# EAGLE design bristol_longshot (EAGLE 7.3.0)
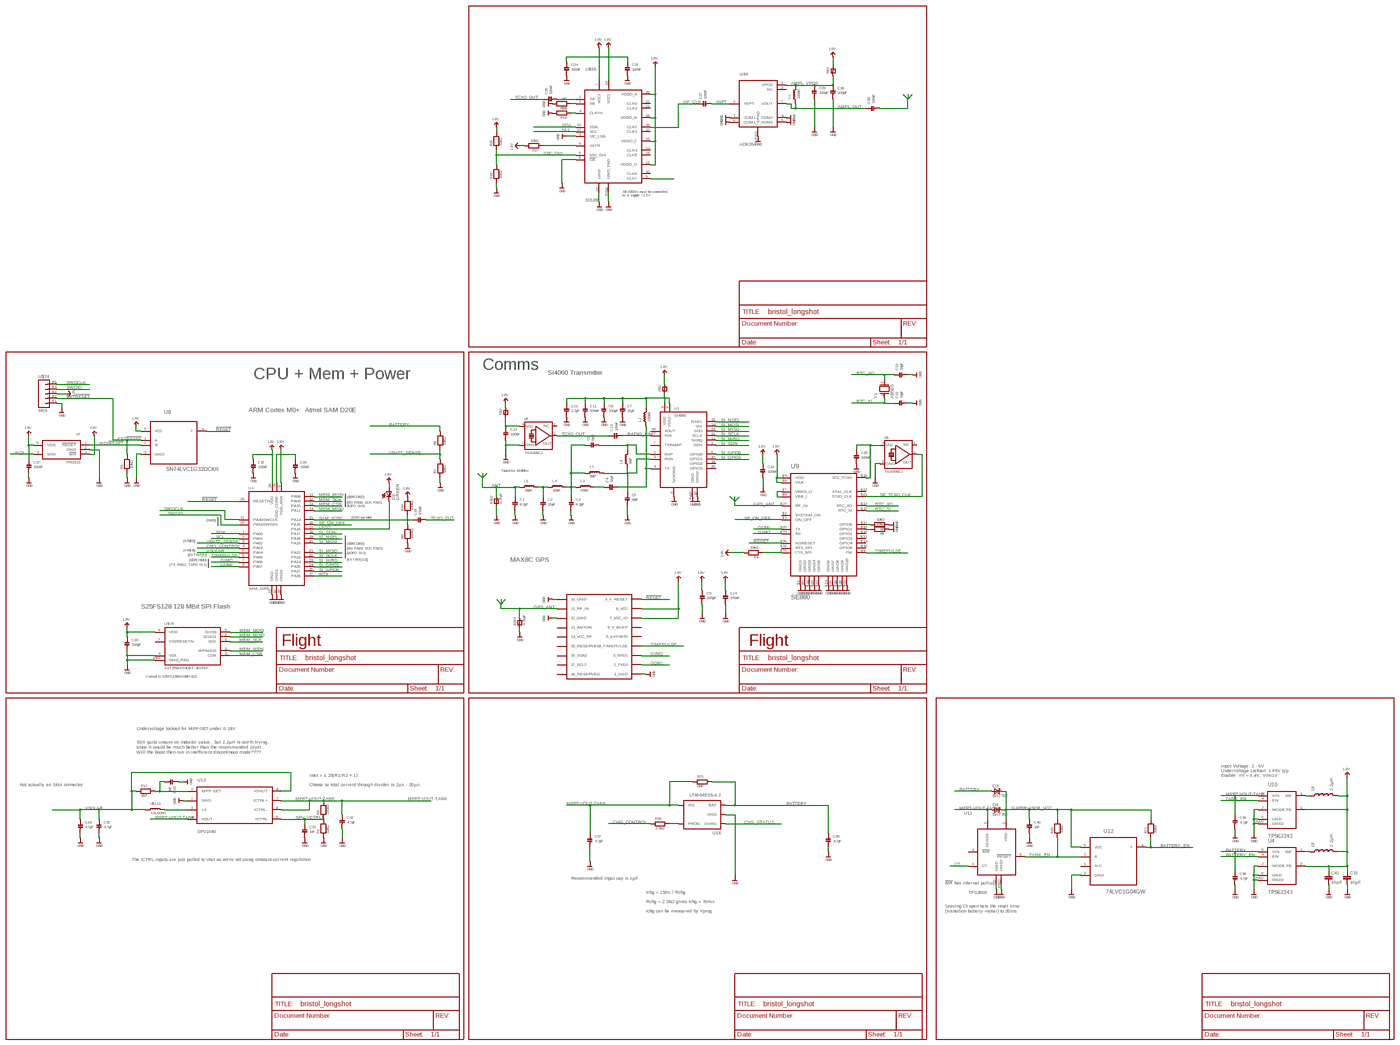
[diagram p0: schematic, sheet 1, overview]
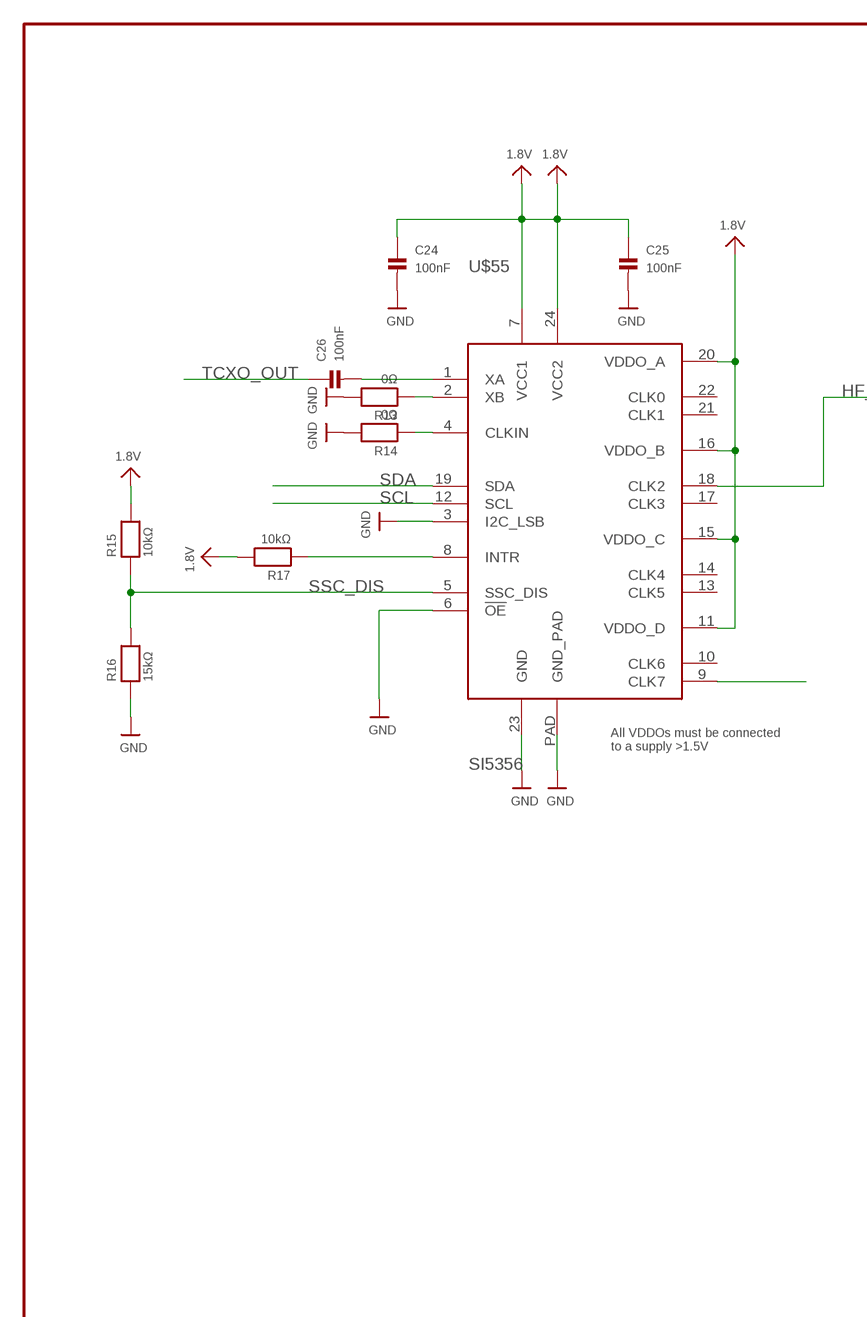
[diagram p1: schematic, sheet 1, part 1 of 4]
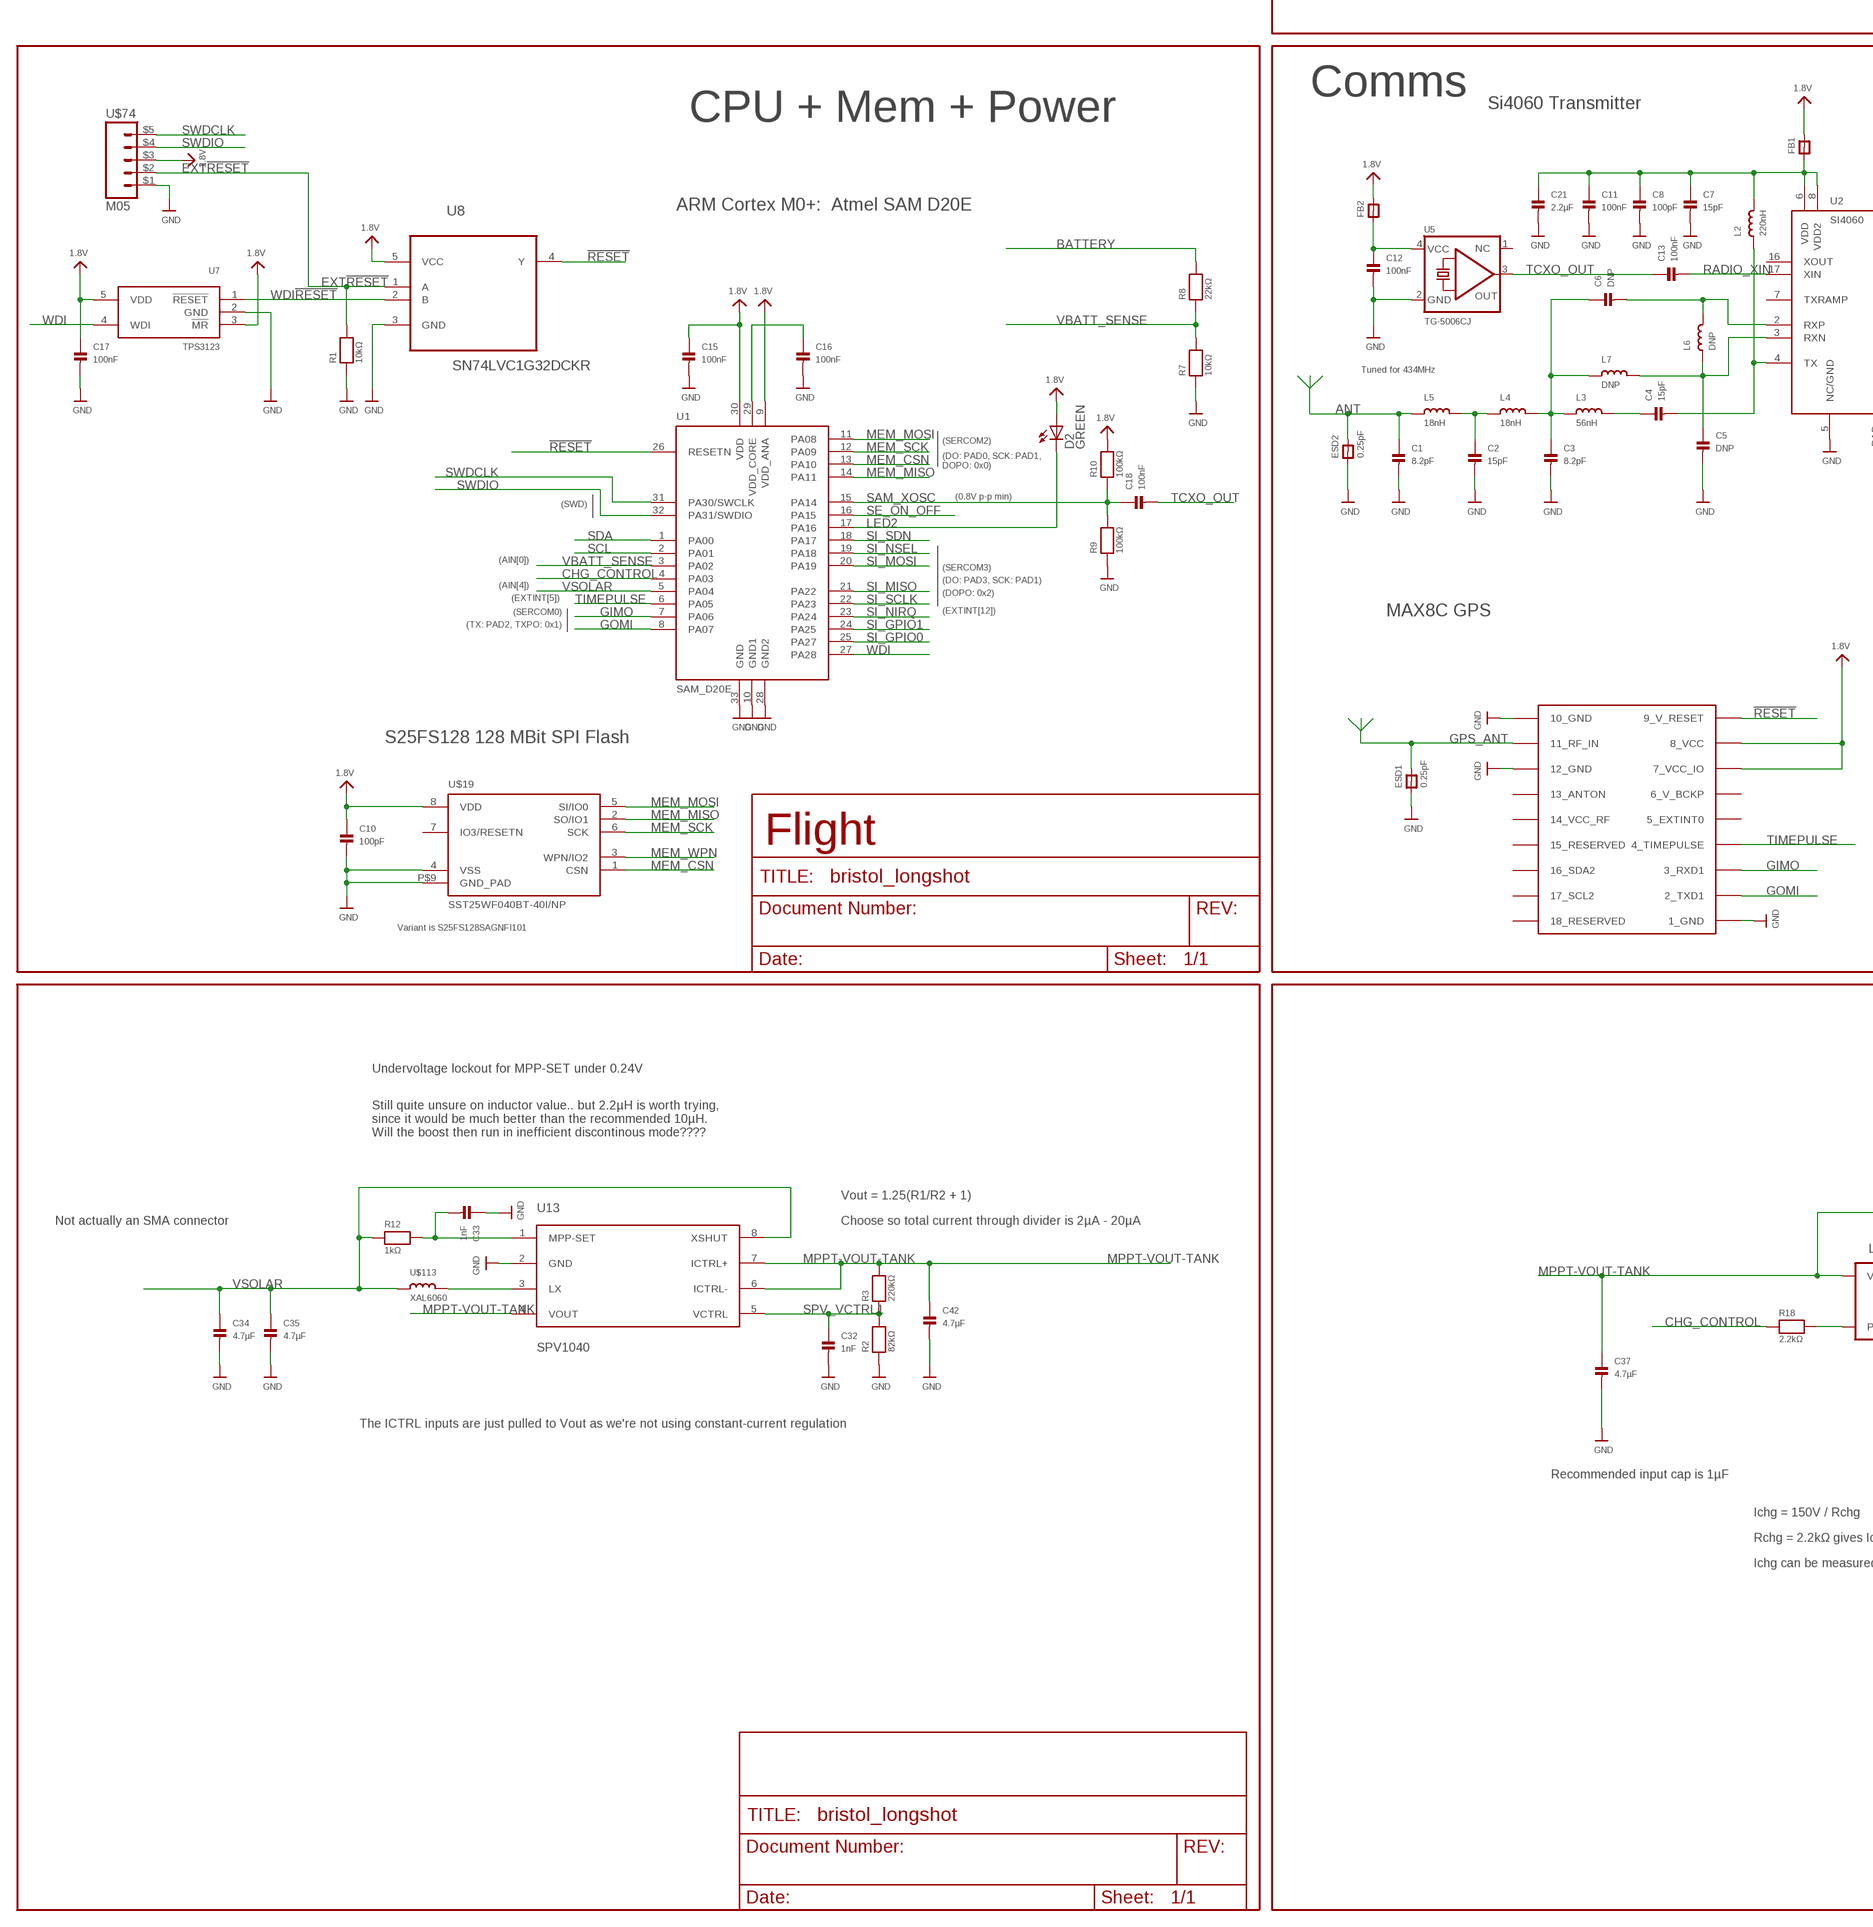
[diagram p2: schematic, sheet 1, part 2 of 4]
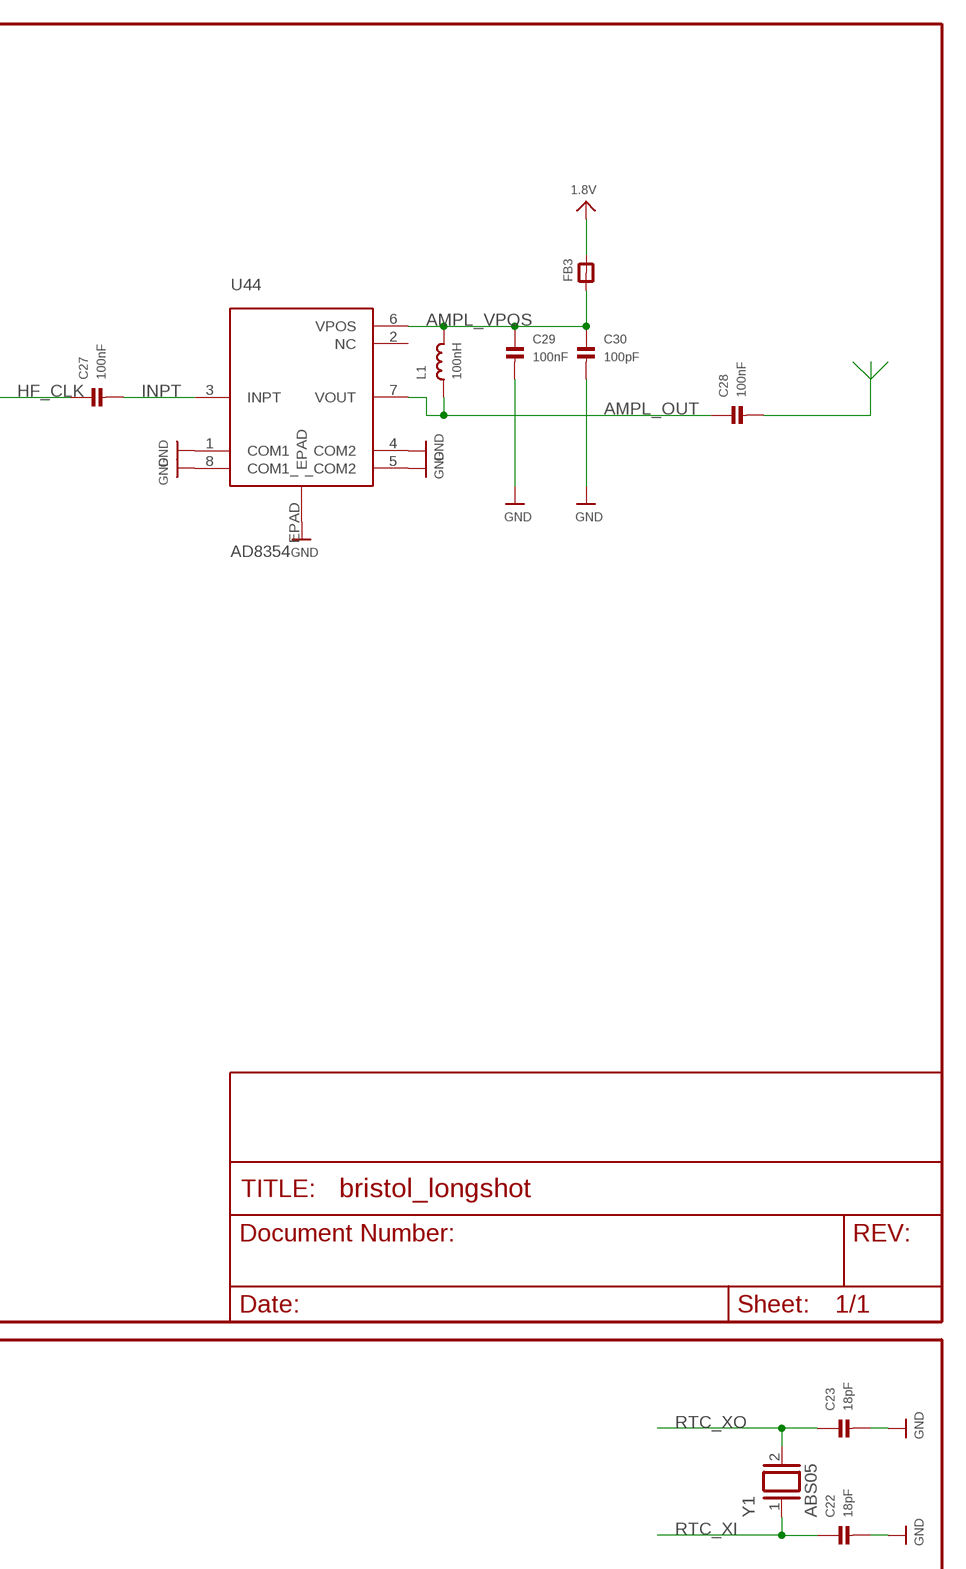
[diagram p3: schematic, sheet 1, part 3 of 4]
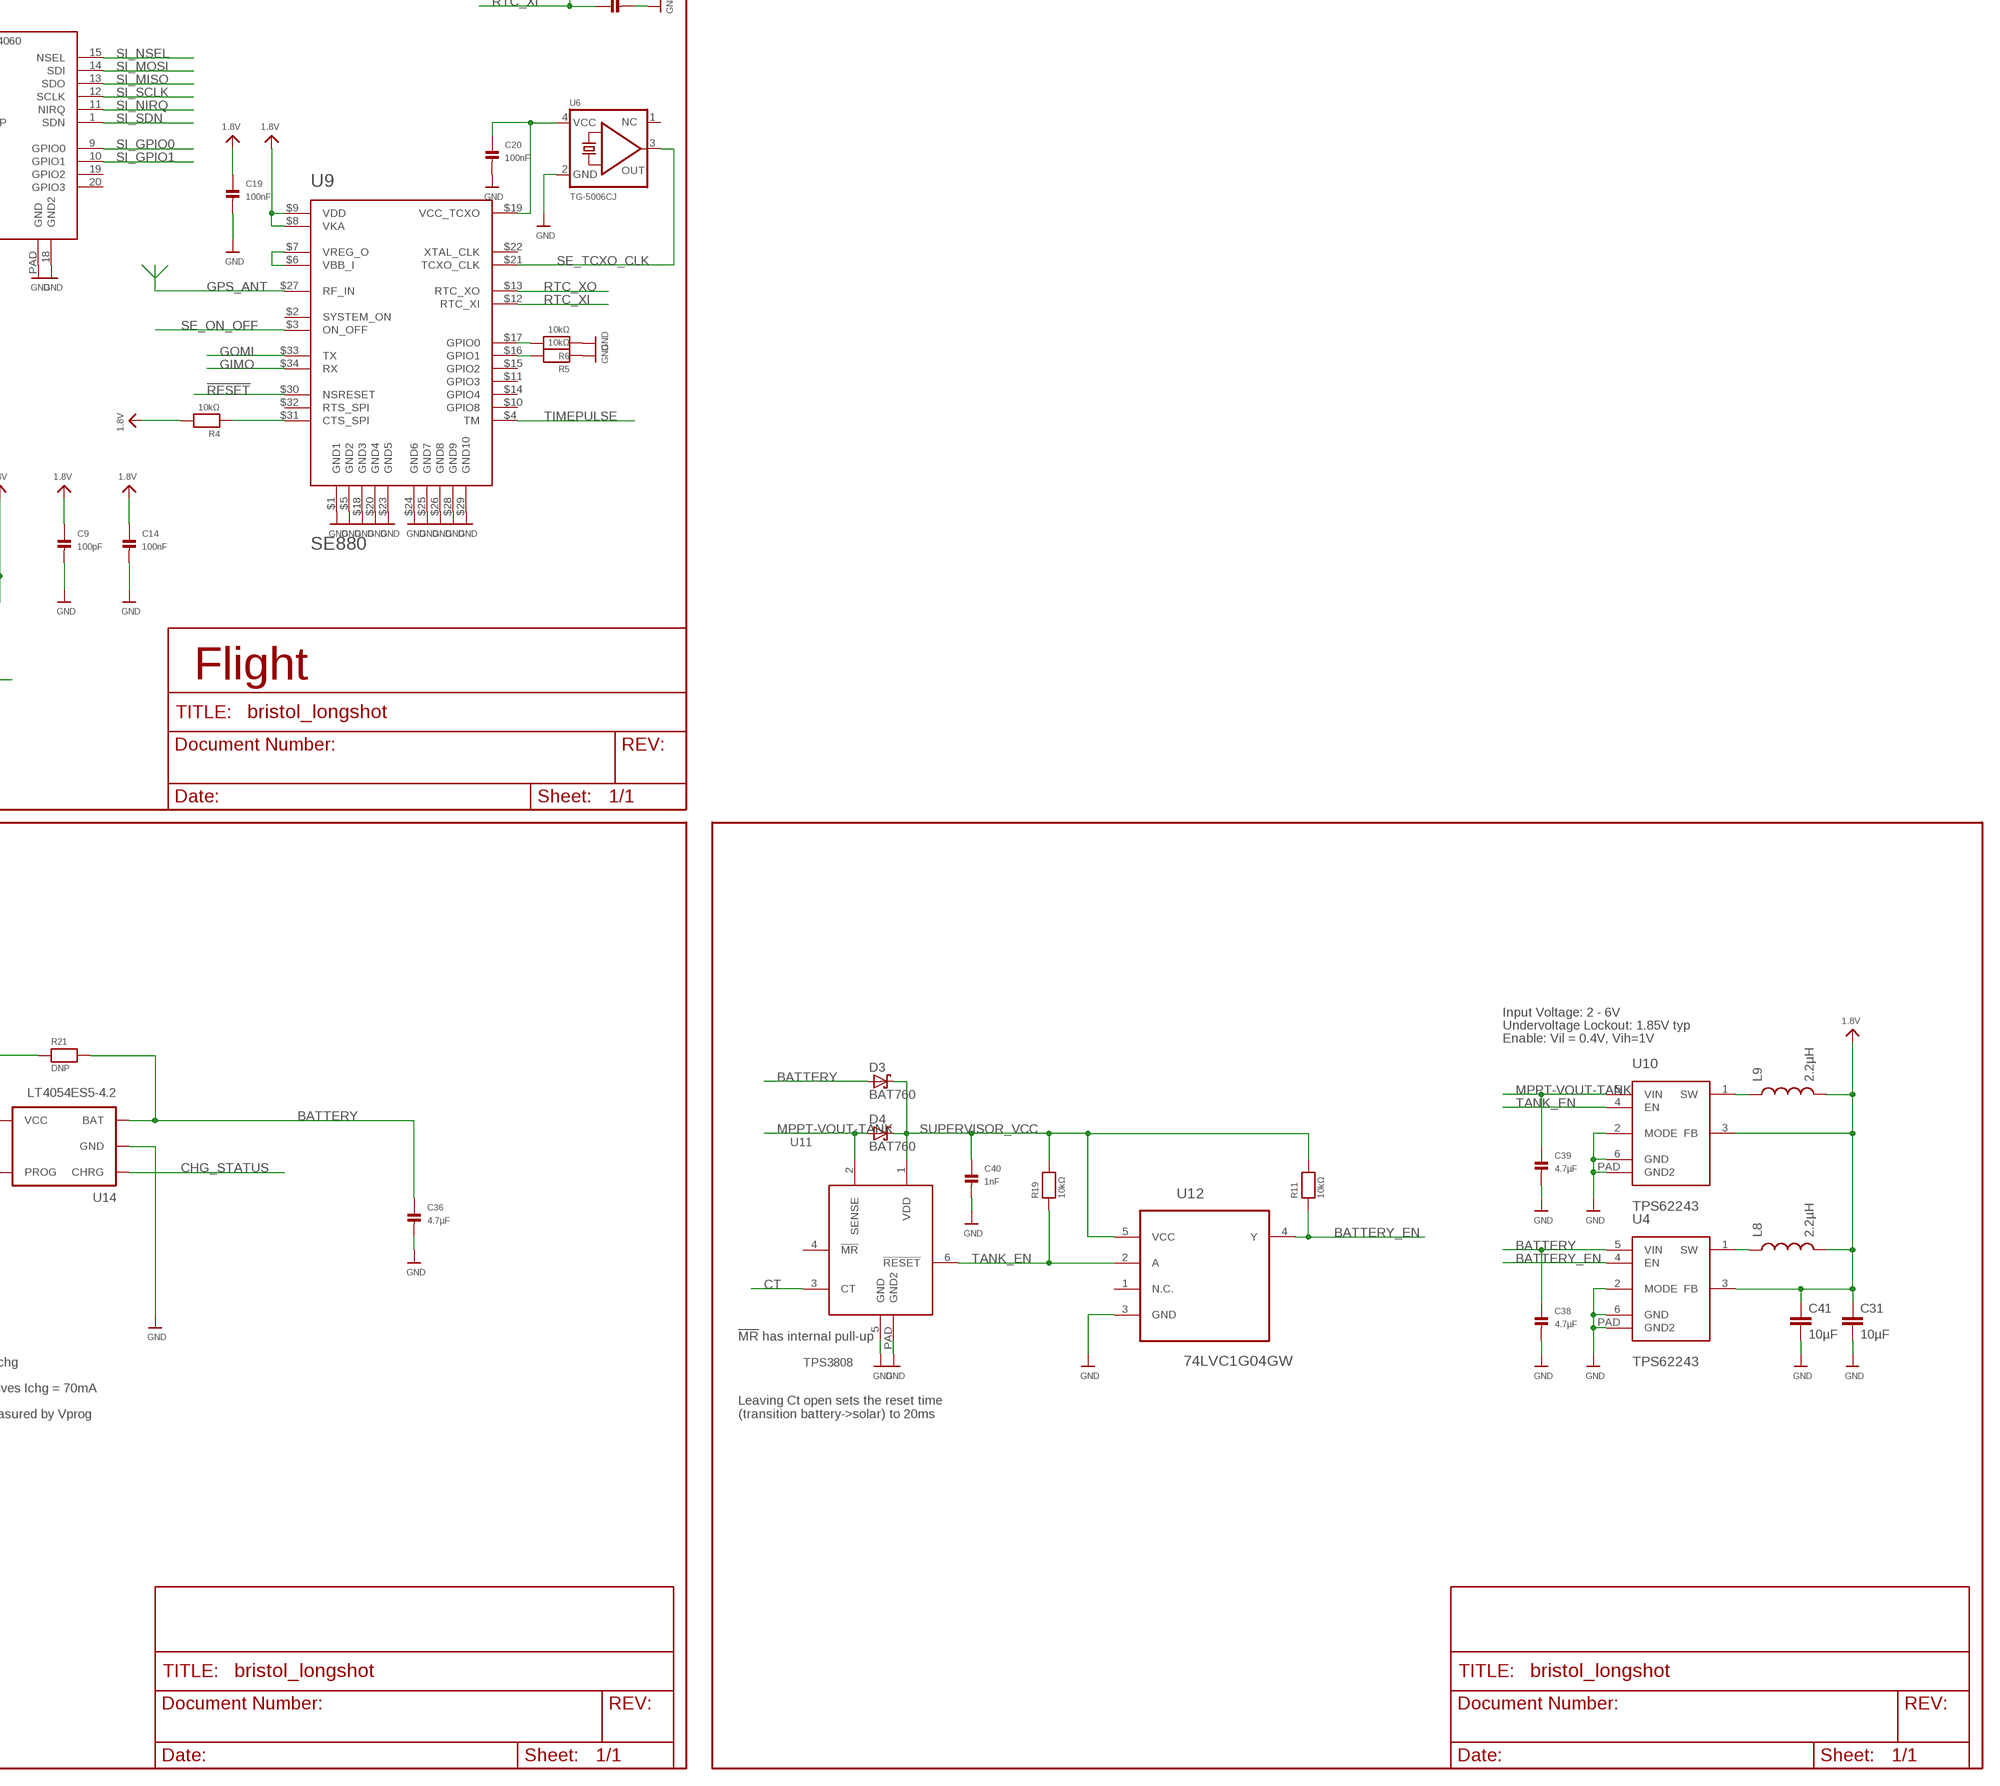
[diagram p4: schematic, sheet 1, part 4 of 4]

## Parts
C1  8.2pF  CAP_CERAMIC_0402  [_0402]
C2  15pF  CAP_CERAMIC_0402  [_0402]
C3  8.2pF  CAP_CERAMIC_0402  [_0402]
C4  15pF  CAP_CERAMIC_0402  [_0402]
C5  DNP  CAP_CERAMIC_0402  [_0402]
C6  DNP  CAP_CERAMIC_0402  [_0402]
C7  15pF  CAP_CERAMIC_0402  [_0402]
C8  100pF  CAP_CERAMIC_0402  [_0402]
C9  100pF  CAP_CERAMIC_0402  [_0402]
C10  100pF  CAP_CERAMIC_0402  [_0402]
C11  100nF  CAP_CERAMIC_0402  [_0402]
C12  100nF  CAP_CERAMIC_0402  [_0402]
C13  100nF  CAP_CERAMIC_0402  [_0402]
C14  100nF  CAP_CERAMIC_0402  [_0402]
C15  100nF  CAP_CERAMIC_0402  [_0402]
C16  100nF  CAP_CERAMIC_0402  [_0402]
C17  100nF  CAP_CERAMIC_0402  [_0402]
C18  100nF  CAP_CERAMIC_0402  [_0402]
C19  100nF  CAP_CERAMIC_0402  [_0402]
C20  100nF  CAP_CERAMIC_0402  [_0402]
C21  2.2µF  CAP_CERAMIC_0402  [_0402]
C22  18pF  CAP_CERAMIC_0402  [_0402]
C23  18pF  CAP_CERAMIC_0402  [_0402]
C24  100nF  CAP_CERAMIC_0402  [_0402]
C25  100nF  CAP_CERAMIC_0402  [_0402]
C26  100nF  CAP_CERAMIC_0402  [_0402]
C27  100nF  CAP_CERAMIC_0402  [_0402]
C28  100nF  CAP_CERAMIC_0402  [_0402]
C29  100nF  CAP_CERAMIC_0402  [_0402]
C30  100pF  CAP_CERAMIC_0402  [_0402]
C31  10µF  C-EUC0603K  [C0603K]
C32  1nF  CAP_CERAMIC_0402  [_0402]
C33  1nF  CAP_CERAMIC_0402  [_0402]
C34  4.7µF  CAP_CERAMIC_0402  [_0402]
C35  4.7µF  CAP_CERAMIC_0402  [_0402]
C36  4.7µF  CAP_CERAMIC_0402  [_0402]
C37  4.7µF  CAP_CERAMIC_0402  [_0402]
C38  4.7µF  CAP_CERAMIC_0402  [_0402]
C39  4.7µF  CAP_CERAMIC_0402  [_0402]
C40  1nF  CAP_CERAMIC_0402  [_0402]
C41  10µF  C-EUC0603K  [C0603K]
C42  4.7µF  CAP_CERAMIC_0402  [_0402]
D2  GREEN  LEDCHIPLED_0603  [CHIPLED_0603]
D3  BAT760  [SOD323]
D4  BAT760  [SOD323]
ESD1  0.25pF  FERRITE_0603MP  [_0603MP]
ESD2  0.25pF  FERRITE_0603MP  [_0603MP]
FB1  FERRITE_0402  [_0402]
FB2  FERRITE_0402  [_0402]
FB3  FERRITE_0402  [_0402]
L1  100nH  INDUCTOR_0402  [_0402]
L2  220nH  INDUCTOR_0402  [_0402]
L3  56nH  INDUCTOR_0402  [_0402]
L4  18nH  INDUCTOR_0402  [_0402]
L5  18nH  INDUCTOR_0402  [_0402]
L6  DNP  INDUCTOR_0402  [_0402]
L7  DNP  INDUCTOR_0402  [_0402]
L8  2.2µH  INDUCTOR1007  [1007]
L9  2.2µH  INDUCTOR1007  [1007]
R1  10kΩ  RESISTOR_0402  [_0402]
R2  82kΩ  RESISTOR_0402  [_0402]
R3  220kΩ  RESISTOR_0402  [_0402]
R4  10kΩ  RESISTOR_0402  [_0402]
R5  10kΩ  RESISTOR_0402  [_0402]
R6  10kΩ  RESISTOR_0402  [_0402]
R7  10kΩ  RESISTOR_0402  [_0402]
R8  22kΩ  RESISTOR_0402  [_0402]
R9  100kΩ  RESISTOR_0402  [_0402]
R10  100kΩ  RESISTOR_0402  [_0402]
R11  10kΩ  RESISTOR_0402  [_0402]
R12  1kΩ  RESISTOR_0402  [_0402]
R13  0Ω  RESISTOR_0402  [_0402]
R14  0Ω  RESISTOR_0402  [_0402]
R15  10kΩ  RESISTOR_0402  [_0402]
R16  15kΩ  RESISTOR_0402  [_0402]
R17  10kΩ  RESISTOR_0402  [_0402]
R18  2.2kΩ  RESISTOR_0402  [_0402]
R19  10kΩ  RESISTOR_0402  [_0402]
R21  DNP  RESISTOR_0402  [_0402]
U1  SAM_D20E  [QFN32_5MM]
U2  SI4060  [QFN20]
U3  UBLOX_MAX  [UBLOX_MAX]
U4  TPS62243  [S-PWSON-N6]
U5  TG-5006CJ  [TC-5006CJ]
U6  TG-5006CJ  [TC-5006CJ]
U7  TPS3123  [SOT23-5]
U8  SN74LVC1G32DCKR  [SOT65P210X110-5N]
U9  SE880  [SE880]
U10  TPS62243  [S-PWSON-N6]
U11  TPS3808  [S-PWSON-N6]
U12  74LVC1G04GW  [SOT65P210X110-5N]
U13  SPV1040  [TSSOP8]
U14  LT4054ES5-4.2  [SOT23-5]
U44  AD8354  [LFCSP_VD_8]
U$19  SST25WF040BT-40I/NP  [USON-8]
U$55  SI5356  [QFN24_4MM]
U$74  M05  [M05_SIDE]
U$113  XAL6060  [XAL60]
Y1  ABS05  [ABS05]

## Nets
1.8V: C9.1 C10.1 C14.1 C15.1 C17.1 C19.1 C24.1 C25.1 C31.1 C41.1 D2.A FB1.2 FB2.2 FB3.2 L8.2 L9.2 R4.2 R10.2 R15.2 R17.2 U1.9(VDD_ANA) U1.30(VDD) U3.7_VCC_IO U3.8_VCC U4.3(FB) U7.3(!MR) U7.5(VDD) U8.5(VCC) U9.$8(VKA) U9.$9(VDD) U10.3(FB) U$19.8(VDD) U$55.7(VCC1) U$55.11(VDDO_D) U$55.15(VDDO_C) U$55.16(VDDO_B) U$55.20(VDDO_A) U$55.24(VCC2) U$74.$3
!RESET: U1.26(RESETN) U3.9_V_RESET U8.4(Y) U9.$30(NSRESET)
AMPL_OUT: C28.1 L1.1 U44.7(VOUT)
AMPL_VPOS: C29.1 C30.1 FB3.1 L1.2 U44.6(VPOS)
ANT: C1.1 ESD2.2 L5.1
BATTERY: C36.1 C38.1 D3.A R8.2 R21.2 U4.5(VIN) U14.3(BAT)
BATTERY_BUCK_SW: L8.1 U4.1(SW)
BATTERY_EN: R11.1 U4.4(EN) U12.4(Y)
CHG_CONTROL: R18.1 U1.4(PA03)
CHG_STATUS: U14.1(CHRG)
CLKIN: R14.1 U$55.4(CLKIN)
CT: U11.3(CT)
EXT!RESET: R1.2 U8.1(A) U$74.$2
FILTER1: C3.1 C6.1 L3.1 L4.2 L7.1
FILTER2: C2.1 L4.1 L5.2
GIMO: U1.7(PA06) U3.3_RXD1 U9.$34(RX)
GND: C1.2 C2.2 C3.2 C5.2 C7.2 C8.2 C9.2 C10.2 C11.2 C12.2 C14.2 C15.2 C16.2 C17.2 C19.2 C20.2 C21.2 C22.2 C23.2 C24.2 C25.2 C29.2 C30.2 C31.2 C32.2 C33.1 C34.2 C35.2 C36.2 C37.2 C38.2 C39.2 C40.2 C41.2 C42.2 ESD1.1 ESD2.1 R1.1 R2.1 R5.1 R6.1 R7.1 R9.1 R13.2 R14.2 R16.1 U1.10(GND1) U1.28(GND2) U1.33(GND) U2.5(NC/GND) U2.18(GND2) U2.PAD(GND) U3.1_GND U3.10_GND U3.12_GND U4.2(MODE) U4.6(GND) U4.PAD(GND2) U5.2(GND) U6.2(GND) U7.2(GND) U8.3(GND) U9.$1(GND1) U9.$5(GND2) U9.$18(GND3) U9.$20(GND4) U9.$23(GND5) U9.$24(GND6) U9.$25(GND7) U9.$26(GND8) U9.$28(GND9) U9.$29(GND10) U10.2(MODE) U10.6(GND) U10.PAD(GND2) U11.5(GND) U11.PAD(GND2) U12.3(GND) U13.2(GND) U14.2(GND) U44.1(COM1) U44.4(COM2) U44.5(_COM2) U44.8(COM1_) U44.EPAD U$19.4(VSS) U$19.P$9(GND_PAD) U$55.3(I2C_LSB) U$55.6(!OE) U$55.23(GND) U$55.PAD(GND_PAD) U$74.$1
GOMI: U1.8(PA07) U3.2_TXD1 U9.$33(TX)
GPS_ANT: ESD1.2 U3.11_RF_IN U9.$27(RF_IN)
HF_ANT: C28.2
HF_CLK: C27.1 U$55.18(CLK2)
INPT: C27.2 U44.3(INPT)
INTR: R17.1 U$55.8(INTR)
LED2: D2.C U1.17(PA16)
LX1: U13.3(LX) U$113.P$2
MEM_CSN: U1.13(PA10) U$19.1(CSN)
MEM_MISO: U1.14(PA11) U$19.2(SO/IO1)
MEM_MOSI: U1.11(PA08) U$19.5(SI/IO0)
MEM_SCK: U1.12(PA09) U$19.6(SCK)
MEM_WPN: U$19.3(WPN/IO2)
MPP-SET: C33.2 R12.2 U13.1(MPP-SET)
MPPT-VOUT-TANK: C37.1 C39.1 C42.1 D4.A R3.2 R21.1 U10.5(VIN) U11.2(SENSE) U13.4(VOUT) U13.6(ICTRL-) U13.7(ICTRL+) U14.4(VCC)
N$3: R6.2 U9.$17(GPIO0)
N$5: R5.2 U9.$16(GPIO1)
N$7: U$55.9(CLK7)
PROG: R18.2 U14.5(PROG)
RADIO_VDD: C7.1 C8.1 C11.1 C21.1 FB1.1 L2.2 U2.6(VDD) U2.8(VDD2)
RADIO_XIN: C13.2 U2.17(XIN)
RF_OUT: C4.2 L2.1 U2.4(TX)
RF_TANK: C4.1 L3.2
RTC_XI: C22.1 U9.$12(RTC_XI) Y1.1
RTC_XO: C23.1 U9.$13(RTC_XO) Y1.2
RXN: C5.1 L6.1 L7.2 U2.3(RXN)
RXP: C6.2 L6.2 U2.2(RXP)
SAM_XOSC: C18.1 R9.2 R10.1 U1.15(PA14)
SCL: U1.2(PA01) U$55.12(SCL)
SDA: U1.1(PA00) U$55.19(SDA)
SE_MODE_PULL: R4.1 U9.$31(CTS_SPI)
SE_ON_OFF: U1.16(PA15) U9.$3(ON_OFF)
SE_TCXO_CLK: U6.3(OUT) U9.$21(TCXO_CLK)
SE_VCO_TCXO: C20.1 U6.4(VCC) U9.$19(VCC_TCXO)
SE_VREG: U9.$6(VBB_I) U9.$7(VREG_O)
SI_GPIO0: U1.25(PA27) U2.9(GPIO0)
SI_GPIO1: U1.24(PA25) U2.10(GPIO1)
SI_MISO: U1.21(PA22) U2.13(SDO)
SI_MOSI: U1.20(PA19) U2.14(SDI)
SI_NIRQ: U1.23(PA24) U2.11(NIRQ)
SI_NSEL: U1.19(PA18) U2.15(NSEL)
SI_SCLK: U1.22(PA23) U2.12(SCLK)
SI_SDN: U1.18(PA17) U2.1(SDN)
SPV_VCTRL1: C32.1 R2.2 R3.1 U13.5(VCTRL)
SSC_DIS: R15.1 R16.2 U$55.5(SSC_DIS)
SUPERVISOR_VCC: C40.1 D3.C D4.C R11.2 R19.2 U11.1(VDD) U12.5(VCC)
SWDCLK: U1.31(PA30/SWCLK) U$74.$5
SWDIO: U1.32(PA31/SWDIO) U$74.$4
TANK_BUCK_SW: L9.1 U10.1(SW)
TANK_EN: R19.1 U10.4(EN) U11.6(!RESET) U12.2(A)
TCXO_OUT: C13.1 C18.2 C26.1 U5.3(OUT)
TCXO_VDD: C12.1 FB2.1 U5.4(VCC)
TIMEPULSE: U1.6(PA05) U3.4_TIMEPULSE U9.$4(TM)
VBATT_SENSE: R7.2 R8.1 U1.3(PA02)
VDD_CORE: C16.1 U1.29(VDD_CORE)
VSOLAR: C34.1 C35.1 R12.1 U1.5(PA04) U13.8(XSHUT) U$113.P$1
WDI: U1.27(PA28) U7.4(WDI)
WDI!RESET: U7.1(!RESET) U8.2(B)
XA: C26.2 U$55.1(XA)
XB: R13.1 U$55.2(XB)
Unconnected: U2.7(TXRAMP) U2.16(XOUT) U2.19(GPIO2) U2.20(GPIO3) U3.5_EXTINT0 U3.6_V_BCKP U3.13_ANTON U3.14_VCC_RF U3.15_RESERVED U3.16_SDA2 U3.17_SCL2 U3.18_RESERVED U5.1(NC) U6.1(NC) U9.$2(SYSTEM_ON) U9.$10(GPIO8) U9.$11(GPIO3) U9.$14(GPIO4) U9.$15(GPIO2) U9.$22(XTAL_CLK) U9.$32(RTS_SPI) U11.4(!MR) U12.1(N.C.) U44.2(NC) U$19.7(IO3/RESETN) U$55.10(CLK6) U$55.13(CLK5) U$55.14(CLK4) U$55.17(CLK3) U$55.21(CLK1) U$55.22(CLK0)

## Notes on the sheet
- All VDDOs must be connected
  to a supply >1.5V
- Comms
- Si4060 Transmitter
- CPU + Mem + Power
- ARM Cortex M0+:  Atmel SAM D20E
- Tuned for 434MHz
- (SERCOM2)
- (DO: PAD0, SCK: PAD1,
  DOPO: 0x0)
- (0.8V p-p min)
- (SWD)
- (AIN[0])
- (SERCOM3)
- (DO: PAD3, SCK: PAD1)
- (AIN[4])
- (DOPO: 0x2)
- (EXTINT[5])
- (SERCOM0) | (EXTINT[12]) | MAX8C GPS
- (TX: PAD2, TXPO: 0x1)
- S25FS128 128 MBit SPI Flash
- Flight | Flight
- Variant is S25FS128SAGNFI101
- Undervoltage lockout for MPP-SET under 0.24V
- Still quite unsure on inductor value.. but 2.2µH is worth trying,
  since it would be much better than the recommended 10µH.
  Will the boost then run in inefficient discontinous mode????
- Input Voltage: 2 - 6V
- Undervoltage Lockout: 1.85V typ
- Vout = 1.25(R1/R2 + 1) | Enable: Vil = 0.4V, Vih=1V
- Not actually an SMA connector | Choose so total current through divider is 2µA - 20µA
- The ICTRL inputs are just pulled to Vout as we're not using constant-current regulation
- Recommended input cap is 1µF
- !MR! has internal pull-up
- Ichg = 150V / Rchg
- Rchg = 2.2kΩ gives Ichg = 70mA
- Ichg can be measured by Vprog
- Leaving Ct open sets the reset time
  (transition battery->solar) to 20ms

## Library data of the parts
C1-C30 C32-C40 C42 = microbuilder_v3:CAP_CERAMIC: Ceramic Capacitors 0402 - 0402 Surface Mount Capacitors 16pF 50V 5% [Digikey: 445-4899-2-ND] 18pF 50V 5% [Digikey: 490-1281-2-ND] 22pF 50V 5% [Digikey: 490-1283-2-ND] 68pF 50V 5% [Digikey: 490-1289-2-ND] 0.1uF 10V 10% [Digikey: 490-1318-2-ND] 1.0uF 6.3V 10% [Digikey: 490-1320-2-ND] 0603 - 0603 Surface Mount Capacitors 16 pF 50V 5% [Digikey: 445-5051-2-ND] 22 pF 50V [Digikey: PCC220ACVTR-ND] 33 pF 50V 5% [Digikey: 490-1415-1-ND] 56pF 50V 5% [Digikey: 490-1421-1-ND] 220pF 50V 5% [Digikey: 445-1285-1-ND] 680 pF 50V 2200 pF 50V 5% C0G [Digikey: 445-1297-1-ND] 5600 pF 100V 5% X7R [Digikey: 478-3711-1-ND] 0.1 µF 25V 10% [Digikey: PCC2277TR-ND] 0.22 µF 16V 10% X7R [Digikey: 445-1318-1-ND] 1.0 µF 25V 10% [Digikey: 445-5146-2-ND] 0603 - RF Specific 3pF 250V +/-0.1pF RF [Digikey: 712-1347-1-ND] 18 pF 250V 5% [Digikey: 478-3505-1-ND or 712-1322-1-ND] 56 pF 250V 5% C0G RF [Digikey: 490-4867-1-ND] 68 pF 250V RF [Digikey: 490-4868-1-ND] 0805 - 0805 Surface Mount Capacitors 220 pF 250V 2% RF Ceramic Capacitor [Digikey: 712-1398-1-ND] 1000 pF 50V 2% NP0 Ceramic Capacitor [Digikey: 478-3760-1-ND] 0.1 µF 25V 10% Ceramic Capacitor [Digikey: PCC1828TR-ND] 1.0 µF 16V 10% Ceramic Capacitor[Digikey: 490-1691-2-ND] 10.0 µF 10V 10% Ceramic Capacitor[Digikey: 709-1228-1-ND] 10.0 uF 16V 10% Ceramic Capacitor [Digikey: 478-5165-2-ND] 47 uF 6.3V 20% Ceramic Capacitor [Digikey: 587-1779-1-ND or 399-5506-1-ND] 1206 - 1206 Surface Mount Capacitors 47uF 10V 20% Ceramic Capacitor [Digikey: 490-5528-1-ND or 399-5508-1-ND or 445-6010-1-ND] 100uF 6.3V -20%, +80% Y5V Ceramic Capacitor (Digikey: 490-4512-1-ND, Mouser: 81-GRM31CF50J107ZE1L)
C31 C41 = resistor:C-EU: CAPACITOR, European symbol
D2 = led:LED: LED OSRAM: - CHIPLED LG R971, LG N971, LY N971, LG Q971, LY Q971, LO R971, LY R971 LH N974, LH R974 LS Q976, LO Q976, LY Q976 LO Q996 - Hyper CHIPLED LW Q18S LB Q993, LB Q99A, LB R99A - SideLED LS A670, LO A670, LY A670, LG A670, LP A670 LB A673, LV A673, LT A673, LW A673 LH A674 LY A675 LS A676, LA A676, LO A676, LY A676, LW A676 LS A679, LY A679, LG A679 - Hyper Micro SIDELED® LS Y876, LA Y876, LO Y876, LY Y876 LT Y87S - SmartLED LW L88C, LW L88S LB L89C, LB L89S, LG L890 LS L89K, LO L89K, LY L89K LS L896, LA L896, LO L896, LY L896 - TOPLED LS T670, LO T670, LY T670, LG T670, LP T670 LSG T670, LSP T670, LSY T670, LOP T670, LYG T670 LG T671, LOG T671, LSG T671 LB T673, LV T673, LT T673, LW T673 LH T674 LS T676, LA T676, LO T676, LY T676, LB T676, LH T676, LSB T676, LW T676 LB T67C, LV T67C, LT T67C, LS T67K, LO T67K, LY T67K, LW E67C LS E67B, LA E67B, LO E67B, LY E67B, LB E67C, LV E67C, LT E67C LW T67C LS T679, LY T679, LG T679 LS T770, LO T770, LY T770, LG T770, LP T770 LB T773, LV T773, LT T773, LW T773 LH T774 LS E675, LA E675, LY E675, LS T675 LS T776, LA T776, LO T776, LY T776, LB T776 LHGB T686 LT T68C, LB T68C - Hyper Mini TOPLED® LB M676 - Mini TOPLED Santana® LG M470 LS M47K, LO M47K, LY M47K Source: http://www.osram.convergy.de LUXEON: - LUMILED® LXK2-PW12-R00, LXK2-PW12-S00, LXK2-PW14-U00, LXK2-PW14-V00 LXK2-PM12-R00, LXK2-PM12-S00, LXK2-PM14-U00 LXK2-PE12-Q00, LXK2-PE12-R00, LXK2-PE12-S00, LXK2-PE14-T00, LXK2-PE14-U00 LXK2-PB12-K00, LXK2-PB12-L00, LXK2-PB12-M00, LXK2-PB14-N00, LXK2-PB14-P00, LXK2-PB14-Q00 LXK2-PR12-L00, LXK2-PR12-M00, LXK2-PR14-Q00, LXK2-PR14-R00 LXK2-PD12-Q00, LXK2-PD12-R00, LXK2-PD12-S00 LXK2-PH12-R00, LXK2-PH12-S00 LXK2-PL12-P00, LXK2-PL12-Q00, LXK2-PL12-R00 Source: www.luxeon.com KINGBRIGHT: KA-3528ASYC Source: www.kingbright.com
D3 D4 = BAT760:BAT760
ESD1 ESD2 FB1-FB3 = microbuilder_v3:FERRITE: Ferrite Bead 0603 MMZ1608B121C - 120 Ohm @ 100MHz, 600mA, 0.15 Ohm DC Resistance - Digikey: 445-2164-1-ND BK1608HW121-T - 120 Ohm, 600mA Ferrite Chip - Digikey: 587-1876-2-ND 0805 HZ0805B272R-10 - 2.7K Ohm @ 100MHz, 200mA, 0.8 Ohm DC Resistance - Digikey: 240-2504-1-ND (see also Murata BLM21BD272SN1L) MMZ2012Y152B - 1.5K Ohm @ 100MHz, 500mA, 0.4 Ohm DC Resistance - Digikey: 445-1560-1-ND - Mainly for high frequency (80-400MHz) MMZ2012R102A - 1K Ohm @ 100MHz, 500mA, 0.3 Ohm DC Resistance - Digikey: 445-1555-2-ND - More general purpose (10-200MHz)
L1-L7 = microbuilder_v3:INDUCTOR: Inductors
L8 L9 = SparkFun:INDUCTOR: Inductors
R1-R19 R21 = microbuilder_v3:RESISTOR: Resistors 0402 - 0402 Surface Mount Package 22 Ohm 1% 1/16W [Digikey: 311-22.0LRTR-ND] 33 Ohm 5% 1/16W 1.0K 5% 1/16W 1.5K 5% 1/16W 2.0K 1% 1/16W 10.0K 1% 1/16W [Digikey: 311-10.0KLRTR-ND] 10.0K 5% 1/16W [Digikey: RMCF0402JT10K0TR-ND] 12.1K 1% 1/16W [Digikey: 311-22.0LRTR-ND] 100.0K 5% 1/16W 0603 - 0603 Surface Mount Package 0 Ohm 1/10 Watt 1% Resistor 15 Ohm 1/10 Watt 1% Resistor 33 Ohm 1/10 Watt 1% Resistor 49.9 Ohm 1/10 Watt 1% Resistor 100 Ohm 1/10 Watt 1% Resistor 150 Ohm 1/10 Watt 1% Resistor 240 Ohm 1/10 Watt 1% Resistor 390 Ohm 1/10 Watt 1% Resistor 560 Ohm 1/10 Watt 1% Resistor 680 Ohm 1/10 Watt 1% Resistor 750 Ohm 1/10 Watt 1% Resistor 1.0K Ohm 1/10 Watt 1% Resistor 1.5K Ohm 1/10 Watt 1% Resistor 2.0K Ohm 1/10 Watt 1% Resistor 2.2K Ohm 1/10 Watt 1% Resistor 3.3K Ohm 1/10 Watt 1% Resistor 4.7K Ohm 1/10 Watt 1% Resistor 10.0K Ohm 1/10 Watt 1% Resistor 12.0K Ohm 1/10 Watt 1% Resistor 12.1K Ohm 1/10 Watt 1% Resistor 20.0K Ohm 1/10 Watt 1% Resistor 33.0K Ohm 1/10 Watt 1% Resistor 100.0K Ohm 1/10 Watt 1% Resistor 0805 - 0805 Surface Mount Package 0 Ohm 1/8 Watt 1% Resistor 33 Ohm 1/8 Watt 1% Resistor 100 Ohm 1/8 Watt 1% Resistor 150 Ohm 1/8 Watt 1% Resistor 200 Ohm 1/8 Watt 1% Resistor 240 Ohm 1/8 Watt 1% Resistor 330 Ohm 1/8 Watt 1% Resistor 390 Ohm 1/8 Watt 1% Resistor 470 Ohm 1/8 Watt 1% Resistor 1.0K Ohm 1/8 Watt 1% Resistor 1.5K Ohm 1/8 Watt 1% Resistor 2.0K Ohm 1/8 Watt 1% Resistor 4.7K Ohm 1/8 Watt 1% Resistor 5.1K Ohm 1/8 Watt 1% Resistor 5.6K Ohm 1/8 Watt 1% Resistor 10.0K Ohm 1/8 Watt 1% Resistor 22.0K Ohm 1/8 Watt 1% Resistor 33.0K Ohm 1/8 Watt 1% Resistor 100K Ohm 1/8 Watt 1% Resistor 1206 - 1206 Surface Mount Package 2012 - 2010 Surface Mount Package 0.11 Ohm 1/2 Watt 1% Resistor - Digikey: RHM.11UCT-ND
U1 = fbri:SAM_D20E
U2 = fbri:SI4060
U3 = Ava:UBLOX_MAX: UBLOX MAX
U4 U10 = TPS62243:TPS62243
U5 U6 = fbri:TG-5006CJ
U7 = TPS3125:TPS3123
U8 = SN74LVC1G32DCKR:SN74LVC1G32DCKR: 2-INPUT POSITIVE-OR GATE; MPN: SN74LVC1G32DCKR; OC_FARNELL: 1470880; OC_NEWARK: 76C4094; PACKAGE: SC-70-5; SUPPLIER: Texas Instruments
U9 = fbri:SE880
U11 = TPS3808:TPS3808
U12 = 74LVC1G04GW_inverter:74LVC1G04GW: Single inverter; MPN: 74LVC1G04GW; OC_FARNELL: 1631683; OC_NEWARK: 03P2774; PACKAGE: SOT-5; SUPPLIER: NXP
U13 = spv1040:SPV1040
U14 = XYKlib:LT4054: Standalone Linear Li-Ion Battery Charger A complete constant-current/constant voltage linear charger for single cell lithium-ion batteries.in SOT-23-5 package.
U44 = fbri:AD8354
U$19 = fbri:SST25WF040BT-40I/NP
U$55 = si5356:SI5356
U$74 = fbri:M05
U$113 = XAL6060:XAL6060
Y1 = fbri:ABS05

## Board
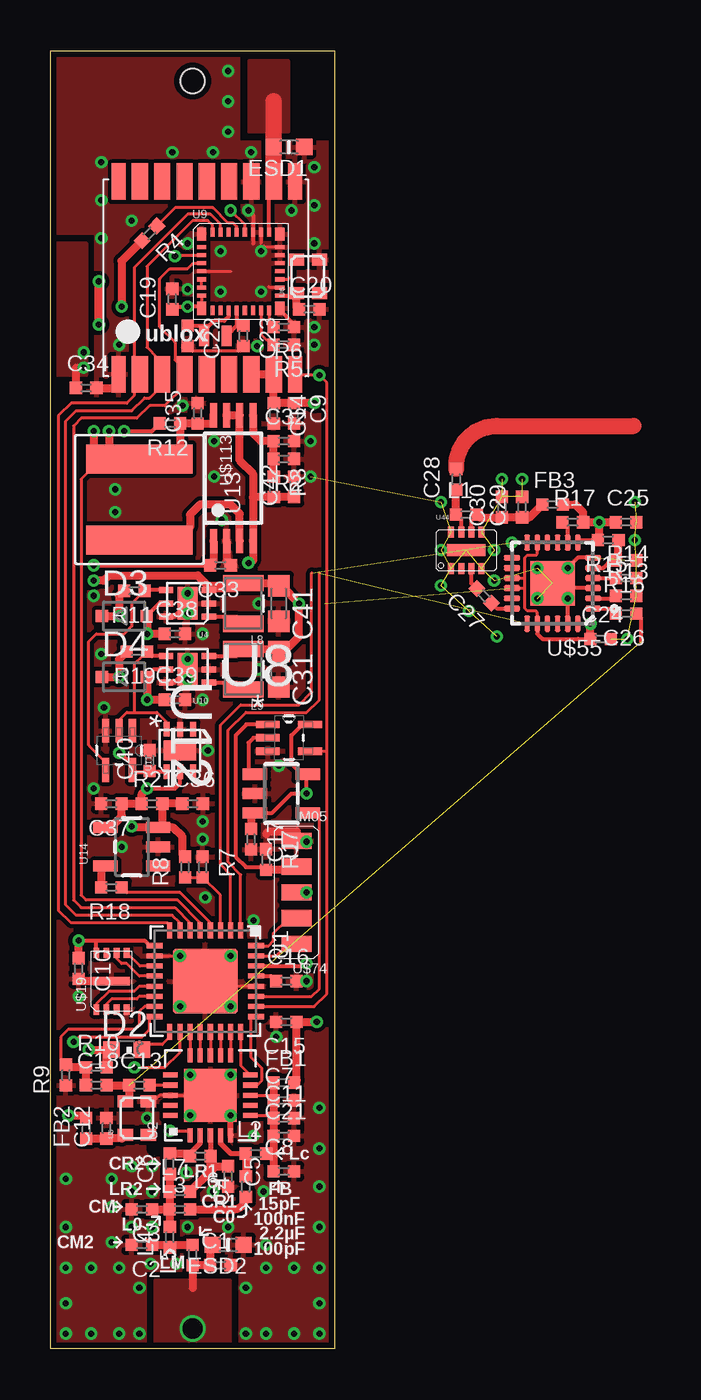
[diagram p5: board, top side]
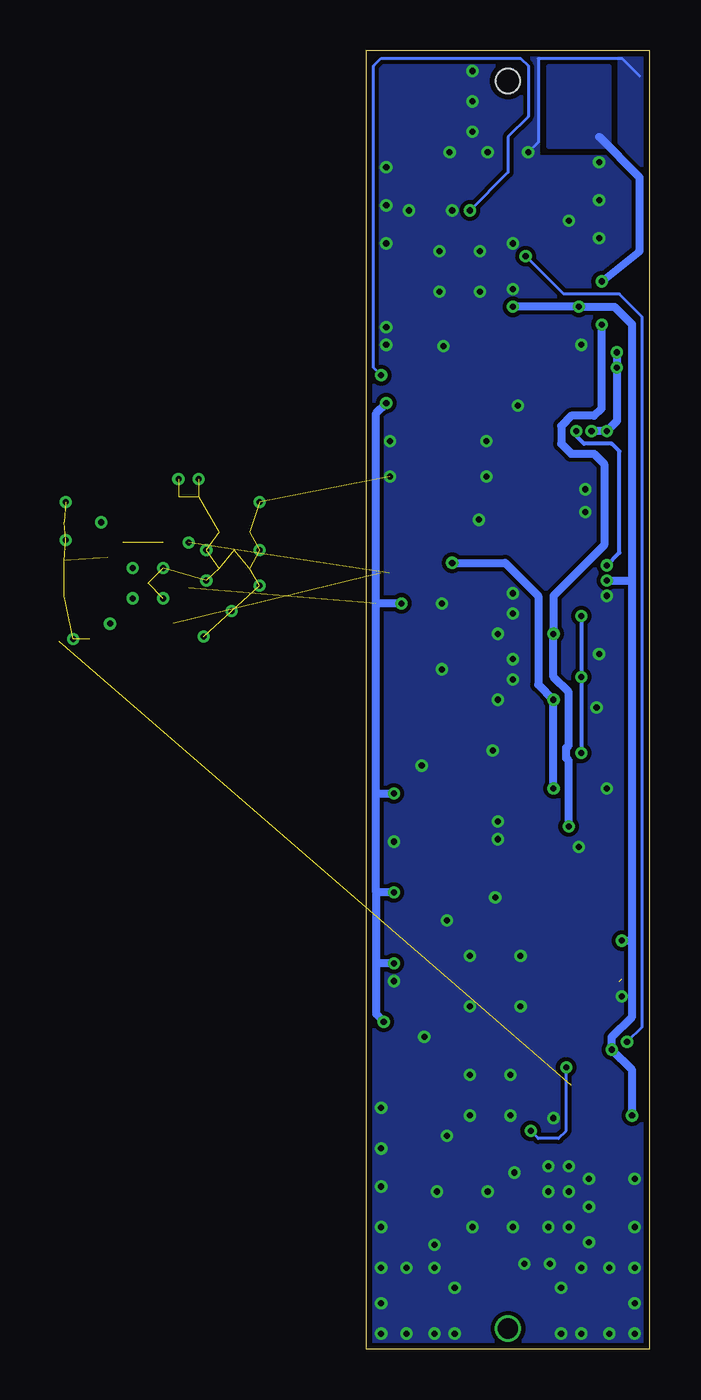
[diagram p6: board, bottom side, seen from below]

Size 14 x 64 mm. Coordinates in mm from the lower left corner, seen from the top.
Outline: 0,0 0,64 14,64 14,0 0,0
Copper layers (1*16): Top 0.035mm / dielectric 1.5mm / Bottom 0.035mm
Design rules "PCB-POOL Standard *": minimum track width 0.15mm, minimum drill 0.3mm, track to track 0.15mm, track to pad 0.15mm, pad to pad 0.15mm, via to via 0.15mm, smd to smd 0.15mm, copper to edge 0.3mm, drill to drill 0.2mm, minimum pad ring 0.2mm, minimum via ring 0.15mm, stop-mask expansion 0.075mm, vias tented up to drill 0.3mm, thermal gap 0.2mm
Holes 1.2 mm at 7,62.5
tRestrict: area 6.3,10.2 to 6.5,10.3; area 5,9.8 to 5.2,10

### Footprints (pad centres in the part's own frame; a part is rotated, then mirrored left to right if it is on the bottom)
_0402 = smd 0.6 x 0.6: 1 -0.508,0; 2 0.508,0
C0603K = smd 1.05 x 1.08: 1 -0.875,0; 2 0.875,0
CHIPLED_0603 = smd 0.8 x 0.8: A 0,-0.75; C 0,0.75
SOD323 = smd 0.6 x 0.6: A 1.1,0; C -1.1,0
_0603MP = smd 0.8 x 0.8: 1 -0.762,0; 2 0.762,0
1007 = smd 2 x 0.8: 1 0,1; 2 0,-1
QFN32_5MM = smd 0.8 x 0.25: 1 -2.5,1.75; 2 -2.5,1.25; 3 -2.5,0.75; 4 -2.5,0.25; 5 -2.5,-0.25; 6 -2.5,-0.75; 7 -2.5,-1.25; 8 -2.5,-1.75; 17 2.5,-1.75; 18 2.5,-1.25; 19 2.5,-0.75; 20 2.5,-0.25; 21 2.5,0.25; 22 2.5,0.75; 23 2.5,1.25; 24 2.5,1.75 | smd 0.25 x 0.8: 9 -1.75,-2.5; 10 -1.25,-2.5; 11 -0.75,-2.5; 12 -0.25,-2.5; 13 0.25,-2.5; 14 0.75,-2.5; 15 1.25,-2.5; 16 1.75,-2.5; 25 1.75,2.5; 26 1.25,2.5; 27 0.75,2.5; 28 0.25,2.5; 29 -0.25,2.5; 30 -0.75,2.5; 31 -1.25,2.5; 32 -1.75,2.5 | smd 3.2 x 3.2: 33 0,0
QFN20 = smd 0.7 x 0.25: 1 -1.97,1; 2 -1.97,0.5; 3 -1.97,0; 4 -1.97,-0.5; 5 -1.97,-1; 11 1.97,-1; 12 1.97,-0.5; 13 1.97,0; 14 1.97,0.5; 15 1.97,1 | smd 0.25 x 0.7: 6 -1,-1.97; 7 -0.5,-1.97; 8 0,-1.97; 9 0.5,-1.97; 10 1,-1.97; 16 1,1.97; 17 0.5,1.97; 18 0,1.97; 19 -0.5,1.97; 20 -1,1.97 | smd 2.6 x 2.6: PAD 0,0
UBLOX_MAX = smd 1.8 x 0.7: 1_GND 4.95,-4.4; 9_V_RESET 4.95,4.3; 10_GND -4.55,4.3; 18_RESERVED -4.55,-4.4 | smd 1.8 x 0.8: 2_TXD1 4.95,-3.35; 3_RXD1 4.95,-2.25; 4_TIMEPULSE 4.95,-1.15; 5_EXTINT0 4.95,-0.05; 6_V_BCKP 4.95,1.05; 7_VCC_IO 4.95,2.15; 8_VCC 4.95,3.25; 11_RF_IN -4.55,3.25; 12_GND -4.55,2.15; 13_ANTON -4.55,1.05; 14_VCC_RF -4.55,-0.05; 15_RESERVED -4.55,-1.15; 16_SDA2 -4.55,-2.25; 17_SCL2 -4.55,-3.35
S-PWSON-N6 = smd 0.3 x 0.7: 1 -0.65,-1.05; 2 0,-1.05; 3 0.65,-1.05; 4 0.65,1.05; 5 0,1.05; 6 -0.65,1.05 | smd 1.6 x 1: PAD 0,0
TC-5006CJ = smd 0.6 x 0.75: 1 -0.825,-0.565; 2 0.825,-0.565; 3 0.825,0.565; 4 -0.825,0.565
SOT23-5 = smd 0.55 x 1.2: 1 -0.95,-1.3; 2 0,-1.3; 3 0.95,-1.3; 4 0.95,1.3; 5 -0.95,1.3
SOT65P210X110-5N = smd 1.168 x 0.356: 1 -1.041,0.66; 2 -1.041,0; 3 -1.041,-0.66; 4 1.041,-0.66; 5 1.041,0.66
SE880 = smd 0.45 x 0.65: $1 -1.925,1.825; $9 -1.925,-1.825; $18 1.925,-1.825; $26 1.925,1.825 | smd 0.45 x 0.2: $2 -1.925,1.2; $3 -1.925,0.8; $4 -1.925,0.4; $5 -1.925,0; $6 -1.925,-0.4; $7 -1.925,-0.8; $8 -1.925,-1.2; $19 1.925,-1.2; $20 1.925,-0.8; $21 1.925,-0.4; $22 1.925,0; $23 1.925,0.4; $24 1.925,0.8; $25 1.925,1.2 | smd 0.2 x 0.45: $10 -1.4,-1.925; $11 -1,-1.925; $12 -0.6,-1.925; $13 -0.2,-1.925; $14 0.2,-1.925; $15 0.6,-1.925; $16 1,-1.925; $17 1.4,-1.925; $27 1.4,1.925; $28 1,1.925; $29 0.6,1.925; $30 0.2,1.925; $31 -0.2,1.925; $32 -0.6,1.925; $33 -1,1.925; $34 -1.4,1.925
SOT65P210X110-5N' = smd 1.168 x 0.356: 1 -0.965,0.66; 2 -0.965,0; 3 -0.965,-0.66; 4 0.965,-0.66; 5 0.965,0.66
TSSOP8 = smd 1.2 x 0.35: 1 -0.8,0.475; 2 -0.8,-0.175; 3 -0.8,-0.825; 4 -0.8,-1.475; 5 5.4,-1.475; 6 5.4,-0.825; 7 5.4,-0.175; 8 5.4,0.475
LFCSP_VD_8 = smd 0.3 x 0.55: 1 -0.75,-0.9; 2 -0.25,-0.9; 3 0.25,-0.9; 4 0.75,-0.9; 5 0.75,0.9; 6 0.25,0.9; 7 -0.25,0.9; 8 -0.75,0.9 | smd 1.89 x 0.6: EPAD 0,0
USON-8 = smd 0.28 x 0.5: 1 -0.75,-1.4; 2 -0.25,-1.4; 3 0.25,-1.4; 4 0.75,-1.4; 5 0.75,1.4; 6 0.25,1.4; 7 -0.25,1.4; 8 -0.75,1.4 | smd 1.8 x 0.4: P$9 0,0
QFN24_4MM = smd 0.8 x 0.28: 1 -2,1.25; 2 -2,0.75; 3 -2,0.25; 4 -2,-0.25; 5 -2,-0.75; 6 -2,-1.25; 13 2,-1.25; 14 2,-0.75; 15 2,-0.25; 16 2,0.25; 17 2,0.75; 18 2,1.25 | smd 0.28 x 0.8: 7 -1.25,-2; 8 -0.75,-2; 9 -0.25,-2; 10 0.25,-2; 11 0.75,-2; 12 1.25,-2; 19 1.25,2; 20 0.75,2; 21 0.25,2; 22 -0.25,2; 23 -0.75,2; 24 -1.25,2 | smd 2.2 x 2.2: PAD 0,0
M05_SIDE = smd 1.5 x 0.8: $1 0,-2.54; $2 0,-1.27; $3 0,0; $4 0,1.27; $5 0,2.54
XAL60 = smd 1.43 x 5.24: P$1 -2,0; P$2 2,0
ABS05 = smd 0.5 x 1: 1 0.55,0; 2 -0.55,0

### Placement (x,y rotation side)
C1  8.38,4.12 0 top
C2  4.5,5.12 180 top
C3  4.5,6.88 180 top
C4  9.62,8 90 top
C5  8.75,8.5 270 top
C6  5.88,9.12 90 top
C7  11.5,12.25 0 top
C8  11.5,8.75 0 top
C9  12,46.12 270 top
C10  1.38,18.75 270 top
C11  11.5,11.38 0 top
C12  2.75,10.88 90 top
C13  4.38,13 0 top
C14  11,46.12 270 top
C15  11.62,16.12 180 top
C16  11.62,18.12 0 top
C17  9.88,25.12 270 top
C18  2.25,13 0 top
C19  6,51.75 90 top
C20  12.75,51.25 0 top
C21  11.5,10.5 0 top
C22  6.75,49.94 270 top
C23  9.5,49.94 270 top
C24  27.12,35 0 top  (outside the outline)
C25  28.38,40.75 0 top  (outside the outline)
C26  28.38,36.25 180 top  (outside the outline)
C27  21.38,37.12 135 top  (outside the outline)
C28  20,42.88 90 top  (outside the outline)
C29  23.25,41.5 90 top  (outside the outline)
C30  22.25,41.5 90 top  (outside the outline)
C31  11.25,33.5 270 top
C32  11.5,44.75 0 top
C33  8.38,38.62 180 top
C34  1.75,47.38 0 top
C35  7.25,46.12 90 top
C36  7,26.88 0 top
C37  3,26.88 180 top
C38  6.12,35.25 0 top
C39  6.12,32 0 top
C40  4.88,29 90 top
C41  11.25,36.75 270 top
C42  12,42.5 90 top
D2  3.75,14.75 270 top
D3  3.62,36.12 0 top
D4  3.62,33.12 0 top
ESD1  11.75,59.25 180 top
ESD2  8.75,5.12 180 top
FB1  11.5,13.12 0 top
FB2  1.75,10.88 90 top
FB3  24.75,41.62 0 top  (outside the outline)
L1  20.5,41.12 0 top  (outside the outline)
L2  10.12,9.62 0 top
L3  6.38,6.88 0 top
L4  5.88,5.5 90 top
L5  7,4.62 90 top
L6  7.38,9.5 180 top
L7  6.38,7.75 0 top
L8  9.5,36.75 180 top
L9  9.5,33.5 180 top
R1  10.62,24.12 270 top
R2  11.5,43.88 180 top
R3  11,42.5 270 top
R4  4.88,55 225 top
R5  11.5,49.5 180 top
R6  11.5,50.38 180 top
R7  7.5,23.75 270 top
R8  6.62,23.75 90 top
R9  0.75,13.5 90 top
R10  2.25,13.88 0 top
R11  4.12,37.38 180 top
R12  5.88,45.62 180 top
R13  28.38,37.12 0 top  (outside the outline)
R14  28.38,38 0 top  (outside the outline)
R15  27.5,39.88 180 top  (outside the outline)
R16  28.38,38.88 180 top  (outside the outline)
R17  25.75,40.75 0 top  (outside the outline)
R18  3,22.75 180 top
R19  4.25,34.38 180 top
R21  5,26.88 0 top
U1  7.62,18.12 270 top
U2  7.88,12.5 90 top
U3  7.75,53 270 top
U4  6.75,36.75 90 top
U5  4.25,11.38 90 top
U6  12.69,52.88 90 top
U7  11.38,27.38 270 top
U8  11.75,30.12 0 top
U9  9.38,53.12 0 top
U10  6.75,33.5 90 top
U11  6.38,29.5 0 top
U12  74LVC1G04GW  [SOT65P210X110-5N']  3.38,29.5 270 top
U13  8.5,40.62 90 top
U14  4,24.75 90 top
U44  20.5,39.38 0 top  (outside the outline)
U$19  3,18.12 0 top
U$55  24.75,37.75 180 top  (outside the outline)
U$74  12.12,22.5 180 top
U$113  4.38,41.88 270 top
Y1  8.12,49.94 180 top

### Tracks (layer width: path | path; a pad name or v marks a point on that pad's centre or on a via)
1.8V  (via drill 0.3)  (2 unrouted)
  Top 0.15: U9.$8 U9.$9 | U$55.20 24,36.31 23.94,36.38 23.5,36.38 23.38,36.5 23.38,37.5 | 23.38,37.5 23.38,38 | 23.38,38 23.38,39 23.5,39.12 23.94,39.12 24,39.19 U$55.11 | U$55.15 23.38,38 | U$55.16 23.38,37.5 | 7.88,37.62 7.8,37.55 U4.3
  Top 0.2: U9.$9 7.38,51.38 v6.75,51.38 6.01,51.38 C19.1 | U1.30 12.5,18.88 v12.62,19 | U8.5 12.41,30.79 11.88,30.25 11.88,28.82 12.38,28.32 U7.5 12.62,28.27 v12.62,27.38 11.88,27.38 10.93,26.43 U7.3 | U$55.7 26,39.88 R15.2 | U$55.20 24,35.25 24.25,35 C24.1 26,35 | U$55.24 v26.62,35.75 | v1.38,20.12 2.25,20.12 | 2.25,20.12 4.62,20.12 4.88,19.88 U1.9 | U$19.8 2.25,20.12 | U4.3 9.15,37.4 L8.2 | U10.3 9.15,34.15 L9.2
  Top 0.4: U3.7_VCC_IO 9.88,48.02 9.88,47.5 | R10.2 2.76,14.62 D2.A v1.88,14.75 | v0.88,11.5 1.75,11.5 FB2.2 | v3.5,51.38 3.5,53.62 R4.2 | v13.12,16.12 C15.1 12.13,13.25 FB1.2 | U7.3 9.88,26.23 C17.1 | v27.06,40.75 R17.2 26.25,41.25 25.88,41.62 FB3.2 | v27.06,40.75 C25.1 | R15.2 27.06,39.94 v27.06,40.75 | C24.1 v26.62,35.74 v26.62,35.75 | C10.1 v1.38,20.12 | L9.2 11.62,34.5 | L8.2 11.12,37.75 C41.1 11.38,37.62 v12.25,36.75 12.25,35.12 11.62,34.5 | 11.62,34.5 11.5,34.38 C31.1 | 10.88,47.38 10.88,47.5 | 10.88,47.5 10.88,47.92 U3.8_VCC | v13,46.62 13,46.63 C9.1 C14.1 11,47.5 10.88,47.5 | v2.12,37.88 2.62,37.88 2.88,38.12 7.25,38.12 7.8,37.58 7.8,37.55 | 7.88,37.62 8.5,37.62
  Top 0.406: U3.7_VCC_IO U3.8_VCC | U$74.$3 v12.62,22.5
  Bottom 0.4: v1.38,20.12 0.88,20.12 | v0.88,11.5 0.88,13.75 v1.88,14.75 1.88,15.38 0.88,16.38 0.88,20.12 | v6.75,51.38 v3.5,51.38 1.75,51.38 0.88,50.5 0.88,37.88 | v12.62,19 13.5,19 | 13.5,19 13.5,16.5 v13.12,16.12 | v12.62,22.5 13.5,22.5 | 13.5,22.5 13.5,19 | 13.5,22.5 13.5,27.38 | 13.5,27.38 v12.62,27.38 | 13.5,27.38 13.5,36.75 | 13.5,36.75 13.5,46.12 v13,46.62 | 0.88,20.12 0.88,37.88 | v12.25,36.75 13.5,36.75 | v2.12,37.88 0.88,37.88
!RESET  (via drill 0.3)
  Top 0.15: U9.$30 9.57,55.42 v8.88,56.12 | U1.26 13,16.88 13.62,17.5 13.62,29.46 | U8.4 13.62,29.46 | 13.62,29.46 13.62,47.62 v13.25,48 12.1,48 U3.9_V_RESET
  Bottom 0.15: v13.25,48 13.62,48.38 13.62,63.25 13.25,63.62 6.38,63.62 6,63.25 6,60.75 7,59.75 7,58 v8.88,56.12
AMPL_OUT
  Top 0.2: U44.7 20.25,40.87 L1.1
  Top 0.4: L1.1 19.99,42.48 C28.1
AMPL_VPOS
  Top 0.2: U44.6 20.75,40.87 L1.2
  Top 0.4: L1.2 21.14,40.99 C30.1 C29.1 23.61,40.99 FB3.1
ANT  (via drill 1)
  Top 0.406: 7,3 L5.1 C1.1 7.87,5 ESD2.2
  other vias: 7,1
  pour Top: 5.12,0 8.88,0 8.88,3.38 5.12,3.38
BATTERY  (via drill 0.3)
  Top 0.2: U4.5 5.35,36.75 D3.A
  Top 0.4: C38.1 v4.75,35.25 4.75,36.1 D3.A | C36.1 R21.2 5.51,25.7 U14.3 | R8.2 6.5,24.38 6.5,25.25 6.05,25.7 U14.3 | U14.3 4.05,25.7 v4,25.75 | v2.38,50.5 v2.38,52.62
  Bottom 0.4: v4,25.75 4,29 4.12,29.12 4.12,29.62 4,29.75 4,32.38 4.75,33.12 v4.75,35.25 4.75,37.12 2.25,39.62 2.25,43.62 2.75,44.12 3.88,44.12 4.38,44.62 4.38,45.5 3.88,46 2.75,46 2.38,46.38 v2.38,50.5 | v2.38,52.62 0.5,54.12 0.5,57.75 2.5,59.75
  pour Bottom: 2,63.25 2,59.25 5,59.25 5,63.25
BATTERY_BUCK_SW
  Top 0.2: U4.1 9.15,36.1 L8.1
BATTERY_EN
  Top 0.15: U12.4 2.71,28.91 1.88,29.75 1.88,34.88 2.25,35.25 3.62,35.25 4,35.62 4,36.74 R11.1
  Top 0.2: U4.4 4.66,37.4 R11.1
CHG_CONTROL
  Top 0.15: U1.4 7.88,21 6.38,22.5 3.76,22.5 R18.1
CLKIN
  Top 0.2: U$55.4 R14.1
EXT!RESET
  Top 0.2: U8.1 9.66,30.79 9.12,30.25 9.12,24.25 9.62,23.75 10.49,23.75 R1.2
  Top 0.4: U$74.$2 11.97,23.62 R1.2
FILTER1
  Top 0.406: C6.1 5.87,8.62 L7.1 L3.1 | L3.1 5.88,7 L4.2 | C3.1 L3.1
FILTER2
  Top 0.406: C2.1 5.02,5.13 5.88,5.13 | 5.88,5.13 L5.2 | L4.1 5.88,5.13
GIMO
  Top 0.15: U9.$34 7.97,55.4 7.75,55.62 7,55.62 4.75,53.38 4.75,49.38 5.25,48.88 5.25,48.5 U3.3_RXD1 5.5,47.5 4.88,46.88 4.62,46.88 4,46.25 1.25,46.25 0.75,45.75 0.75,21.88 1.25,21.38 6,21.38 6.38,21 U1.7
GND  (via drill 0.3)  (28 unrouted)
  Top 0.15: U9.$28 10.38,54.5 | U9.$25 10.55,54.33 10.5,54.38 | U9.$20 10.8,52.33 10.75,52.38 | U9.$5 8.88,53.12 | C23.2 9.26,49.19 6.99,49.19 C22.2
  Top 0.152: U1.10 v6.38,19.38 U1.33 7.62,19.38 v8.88,19.38 | 6.88,12.25 6.62,12.5 U2.18 5.38,12.5 5.12,12.25 4.87,12.25 U5.2 | U1.28 9,17.88 9,17 v8.88,16.88 | U2.PAD v8.88,13.5
  Top 0.2: 10,54.5 10,55.88 | 11.32,51.3 11.38,51.12 12.01,50.49 R6.1 | U$55.3 25.5,37.5 | U$55.6 26,39 v25.5,38.5 U$55.PAD 25,37.5 25.5,37.5 | U$55.23 v25.5,37 25.5,37.5 | U10.6 6.1,32.85 U10.PAD | U4.6 6.1,36.1 U4.PAD
  Top 0.305: 6.88,12.25 v6.88,11.5 | U2.5 v8.88,11.5
  Top 0.4: 10.63,25.38 10.75,25.5 12.13,25.51 | 12.13,25.51 12.12,25 | U$74.$1 12.1,25.04 12.13,25.51 | U9.$18 11.32,51.3 | 2.25,18.12 1.5,18.12 | U13.2 8.68,38.83 C33.1 | C34.2 3.25,47.38
  Bottom 0.15: 0.5,62.75 1.38,63.62 5.5,63.62 5.5,59.5 v6,59
  other vias: 6.38,16.88 10,10.5 0.75,4 0.75,2.25 0.75,0.75 3.38,0.75 4.38,0.75 4.38,3 3.38,4 9.62,0.75 10.62,0.75 13.25,0.75 13.25,2.25 13.25,4 10.62,4 9.62,3 6.69,8.69 0.75,6 0.75,8.38 5,9 5,6 3,5.25 13.25,6 10.5,7.75 8,7.75 3,7 4,6 6.75,6 10.62,5.12 8.75,6 13.25,8 13.25,9.88 4,7.75 5,7.75 6.19,4.19 4.94,4.19 4.75,11.38 4,9 3,8.38 11.88,56.12 9.75,56.12 13,58.25 13,56.38 2.5,56.62 2.5,58.5 4,55.62 2.5,54.75 3.38,49.5 13,54.5 8,59 9.88,59 8.38,54.12 10.38,54.12 10.38,52.12 8.38,52.12 10.19,49.44 13,50.38 6.75,52.25 2,4 2,0.75 12,4 12,0.75 13.25,11.88 11.12,15.38 12.62,18.12 6.75,54.5 6.88,13.5 11.25,28.75 12.62,25 13,49.5 10,21.12 8.75,60 8.75,63 8.75,61.5 24,37 24,38.5 28.81,39.88 28.44,35 19.25,39.38 19.25,37.62 20.62,36.38 22,35.12 21.88,39.38 21.88,37.88 19.25,41.75 28.81,41.75 22.25,42.88 23.25,42.88 1.38,17.38 7.5,35.25 10.25,36.75 10.25,33.5 7.5,32 6.75,33 6.75,34 6.75,36.25 6.75,37.25 7.75,29.5 6.5,46.5 2.12,27.62 2.62,31.62 3.5,24.75 7.5,26 7.62,22.25 7.5,25.12 12.81,44.75 12.81,43 8.06,44.75 8.06,43 3.19,42.38 3.19,41.25 8.44,40.88 2.12,37.12 2.5,34.25
  pour Top (isolate 0.2): 0,64 9.25,64 9.25,59.5 14,59.5 14,0 9.38,0 9.38,3.88 4.62,3.88 4.62,0 0,0 0,47.25 2.25,47.25 2.25,55 0,55
  pour Bottom (isolate 0.2): 0,64 1.5,64 1.5,58.75 5.5,58.75 5.5,64 14,64 14,0 0,0
GOMI
  Top 0.15: U9.$33 8.38,55.44 7.88,55.94 6.75,55.94 4.12,53.31 4.12,48.33 U3.2_TXD1 | 4.4,47.48 4.12,47.2 4.12,47 3.75,46.62 1,46.62 0.38,46 0.38,21.62 1,21 5.75,21 5.88,20.88 U1.8
  Top 0.2: U3.2_TXD1 4.4,47.48
GPS_ANT
  Top 0.2: U9.$27 10.78,57.33 U3.11_RF_IN
  Top 0.406: U3.11_RF_IN 11,59.24 ESD1.2
  Top 0.819: U3.11_RF_IN 11,61.5
  pour Top: 9.75,60 11.75,60 11.75,63.5 9.75,63.5
HF_ANT
  Top 0.8: C28.2 20,43.5 arc-90 22,45.5 28.75,45.5
HF_CLK
  Top 0.2: C27.1 22,36.5 U$55.18
INPT
  Top 0.2: C27.2 20.75,37.75 U44.3
INTR
  Top 0.2: U$55.8 25.5,40.5 R17.1
LED2
  Top 0.15: U1.17 5.88,15.38 5.5,15 4.62,15
  Top 0.2: 4.62,15 D2.C
LX1
  Top 0.4: U13.3 9.32,41.17 8.88,41.62 7.38,41.62 6.88,41.12 6.88,40.5 6.38,40 4.5,40 U$113.P$2
MEM_CSN
  Top 0.15: U1.13 4.38,17.88 4.12,17.62 2.88,17.62 2.25,17 U$19.1
MEM_MISO
  Top 0.15: U1.14 4.38,17.38 4.25,17.25 3,17.25 2.75,17 U$19.2
MEM_MOSI
  Top 0.15: U1.11 4.4,18.88 U$19.5
MEM_SCK
  Top 0.15: U1.12 4.38,18.38 3.75,19 3.5,19 3.25,19.25 U$19.6
MPP-SET  (via drill 0.3)
  Top 0.2: v2.12,38.62 C33.2 | v3.62,45.25 4.99,45.25 R12.2
  Top 0.4: U13.1 8.03,38.78 C33.2
  Bottom 0.2: v2.12,38.62 1.5,39.25 1.5,44.25 1.88,44.62 3.25,44.62 3.62,45 v3.62,45.25
MPPT-VOUT-TANK  (via drill 0.3)
  Top 0.2: U10.5 5.1,33.5 D4.A 4.75,33.1 | v4.75,27.62 6.12,27.62 6.38,27.88 U11.2
  Top 0.4: 9.97,41.99 9.97,43.15 9.32,43.8 U13.6 U13.7 | 9.97,41.99 U13.4 9.97,38.85 v9.75,38.75 | C42.1 R3.2 9.97,41.99 | 4.75,33.1 v4.75,32 C39.1 | U14.4 2.75,25.75 3,25.75 3.51,26.26 C37.1 R21.1 4.49,27.37 v4.75,27.62
  Bottom 0.4: v9.75,38.75 7.12,38.75 5.5,37.12 5.5,32.75 v4.75,32 v4.75,27.62
N$3
  Top 0.15: U9.$17 10.78,50.59 R6.2
N$5
  Top 0.15: U9.$16 10.38,50 10.62,49.75 10.74,49.75 R5.2
PROG
  Top 0.4: U14.5 2.49,23.72 R18.2
RADIO_VDD
  Top 0.152: U2.8 10.87,12.5 C7.1 10.87,11.38 10.88,11.38 10.88,11.49 10.99,11.5 U2.6
  Top 0.406: FB1.1 C7.1 10.99,11.5 C11.1 C21.1 10.99,9.62 | 10.99,9.62 C8.1 | L2.2 10.99,9.62
RADIO_XIN
  Top 0.152: U2.17 C13.2
RF_OUT
  Top 0.254: U2.4 8.38,10.12 8.88,9.62 L2.1 9.68,9.75
  Top 0.406: L2.1 9.62,9.69 C4.2
RF_TANK
  Top 0.4: L3.2 9.01,6.88 arc90 C4.1
RTC_XI
  Top 0.2: U9.$12 8.78,50.9 8.56,50.69 8.06,50.69 7.81,50.44 | 7.81,50.44 7.58,50.2 Y1.1 | C22.1 7.8,50.45 7.81,50.44
RTC_XO
  Top 0.2: 8.93,50.19 Y1.2 9.18,50.44 9.18,50.5 | U9.$13 9.18,50.5 | C23.1 9.23,50.45 9.18,50.5
RXN
  Top 0.254: U2.3 L6.1
  Top 0.406: L7.2 7.88,8.76 | 7.88,8.76 L6.1 | 7.88,8.76 8.13,9.01 C5.1
RXP
  Top 0.254: U2.2 7.38,10.13 6.88,9.63 | 6.88,9.63 L6.2 | 6.88,9.63 L6.2
  Top 0.406: C6.2 6.86,9.63 L6.2
SAM_XOSC
  Top 0.15: R9.2 0.5,14.25 0.5,15.38 0.88,15.75 4.12,15.75 4.38,16 4.38,16.62 4.62,16.88 U1.15
  Top 0.2: 1.76,13.89 R10.1
  Top 0.4: C18.1 R10.1 0.88,13.88 R9.2
SCL  (via drill 0.3)  (1 unrouted)
  Top 0.15: U1.2 8.88,23.38 8.38,23.88 8.38,30.75 9.38,31.75 12.25,31.75 12.88,32.38 12.88,38.25
  Top 0.2: U$55.12 v22.75,39.75
SDA  (1 unrouted)
  Top 0.15: U1.1 9.38,23.38 8.75,24 8.75,30.5 9.62,31.38 12.62,31.38 13.25,32 13.25,38.25
SE_MODE_PULL
  Top 0.15: U9.$31 9.18,55.33 9,55.5 8.75,55.5 8,56.25 6.12,56.25 R4.1
SE_ON_OFF  (via drill 0.3)
  Top 0.15: U9.$3 6.17,53.92 v6.12,53.88 | U1.16 4.88,16.38 4.88,15.75 4.5,15.38 1.38,15.38 v1.12,15.12
  Bottom 0.15: v1.12,15.12 0.38,15.88 0.38,50.88 1.5,52 4.25,52 v6.12,53.88
SE_TCXO_CLK
  Top 0.15: U9.$21 11.72,52.73 11.88,52.88 11.88,53.52 U6.3
SE_VCO_TCXO
  Top 0.2: U9.$19 11.94,51.92 U6.4
  Top 0.4: C20.1 12.12,51.37 U6.4
SE_VREG
  Top 0.15: U9.$7 U9.$6
SI_GPIO0
  Top 0.15: 10.42,13.83 9.88,14.38 9.88,16.38 U1.25
  Top 0.152: U2.9 10.19,13 10.42,13.24 10.42,13.83 | 10.17,16.33 U1.25
SI_GPIO1
  Top 0.15: U1.24 9.38,13.97 U2.10
  Top 0.152: 9.62,13.5 U2.10
SI_MISO
  Top 0.152: U1.21 U2.13
SI_MOSI
  Top 0.152: U1.20 U2.14
SI_NIRQ
  Top 0.152: U1.23 U2.11
SI_NSEL
  Top 0.152: U1.19 U2.15
SI_SCLK
  Top 0.152: U1.22 U2.12
SI_SDN  (via drill 0.3)
  Top 0.15: v4.12,13.88 5.62,13.88 6.38,14.62 U1.18
  Top 0.152: 6.88,10.72 U2.1 6.88,10.75 v5.88,10.75
  Bottom 0.152: v4.12,13.88 4.12,10.75 4.5,10.38 5.5,10.38 v5.88,10.75
SPV_VCTRL1
  Top 0.4: R3.1 R2.2 C32.1 10.38,44.75 10,45.12 10,46 U13.5
SSC_DIS
  Top 0.2: U$55.5 27.25,38.5 27.5,38.75 27.74,38.75 R16.2
  Top 0.4: R16.2 28,39 28,39.74 R15.1
SUPERVISOR_VCC  (via drill 0.3)
  Top 0.2: U11.1 4.83,28.45 | 4.83,28.45 4.12,28.45 U12.5 4.04,28.84 v3.38,29.38 | 4.83,28.45 C40.1
  Top 0.4: D4.C v3.38,33.12 3.38,34.01 R19.2 | D3.C v3.38,36.12 3.38,37.13 R11.2
  Bottom 0.2: v3.38,29.38 v3.38,33.12 v3.38,36.12
SWDCLK
  Top 0.15: U1.31 11.12,19.38 11.5,19.75 11.91,19.75 U$74.$5
SWDIO
  Top 0.15: U1.32 10.75,19.88 11,20.12 11,20.5 11.62,21.12 12.02,21.12 U$74.$4
TANK_BUCK_SW
  Top 0.2: U10.1 9.15,32.85 L9.1
TANK_EN
  Top 0.15: U11.6 5.75,30.7 5.75,30.88 5.25,31.38 4.12,31.38 | 4.98,34.15 4.53,34.15 4.12,33.75 4.12,31.38 | U12.2 3.38,31 3.75,31.38 4.12,31.38
  Top 0.2: U10.4 4.98,34.15 R19.1
TCXO_OUT  (1 unrouted)
  Top 0.2: C13.1 3.38,13 | 29.12,34.88 29.12,36.01 C26.1
  Top 0.4: C18.2 C13.1
  Top 0.406: C13.1 3.87,12.38 U5.3
TCXO_VDD
  Top 0.4: FB2.1 C12.1 3.5,10.37 U5.4
TIMEPULSE
  Top 0.15: U9.$4 7.03,53.52 6.75,53.25 5.88,53.25 5.38,52.75 5.38,50.38 6.12,49.62 6.12,48.75 6.35,48.52 | 6.6,47.48 5.62,46.5 4.88,46.5 4.25,45.88 1.5,45.88 1.12,45.5 1.12,22.12 1.5,21.75 6.12,21.75 6.88,21 U1.6
  Top 0.2: 6.35,48.52 U3.4_TIMEPULSE 6.6,47.48
VBATT_SENSE
  Top 0.15: U1.3 8.38,22.37 R7.2 R8.1
VDD_CORE
  Top 0.2: U1.29 10.88,18.38 11.12,18.13 C16.1
VSOLAR  (via drill 0.3)
  Top 0.15: 6.25,43.88 5.75,43.38 2.12,43.38 2,43.38 1.5,42.88 1.5,22.38 1.75,22.12 6.25,22.12 7.38,21 U1.5
  Top 0.4: U$113.P$1 6.25,43.88 6.38,44 R12.1 C35.1 7.99,45.62 8.03,45.65 U13.8 | v2.12,45.25 2.12,43.38 | v2.88,45.25 2.88,43.62 | C34.1 1.25,48.38 v1.62,48.38
  Bottom 0.4: v1.62,49.12 v1.62,48.38 1.62,45.75 v2.12,45.25 v2.88,45.25
  pour Top: 0,54.5 1.75,54.5 1.75,48 0,48
WDI
  Top 0.15: U1.27 12.88,17.38 13.25,17.75 13.25,26.43 U7.4
WDI!RESET
  Top 0.2: U8.2 10,30.12 9.75,29.88 9.75,28.4 U7.1
XA
  Top 0.2: U$55.1 27.63,36.5 C26.2
XB
  Top 0.2: U$55.2 27.74,37 R13.1

### Text on the board
tPlace: CR2 | Lc | LR2 | LR1 | CM | CR1 | L0 | C0 | CM2 | FB / 15pF / 100nF / / 100pF | 2.2µF | LM
tStop: V0.981.0 | GPS | BRISTOL | UNIVERSITY | ARM / - / SWD
bStop: +vbat | -vbat | (C) Richard Meadows 2015